# EAGLE design Display-Board_Rack-PDU (EAGLE 9.6.2)
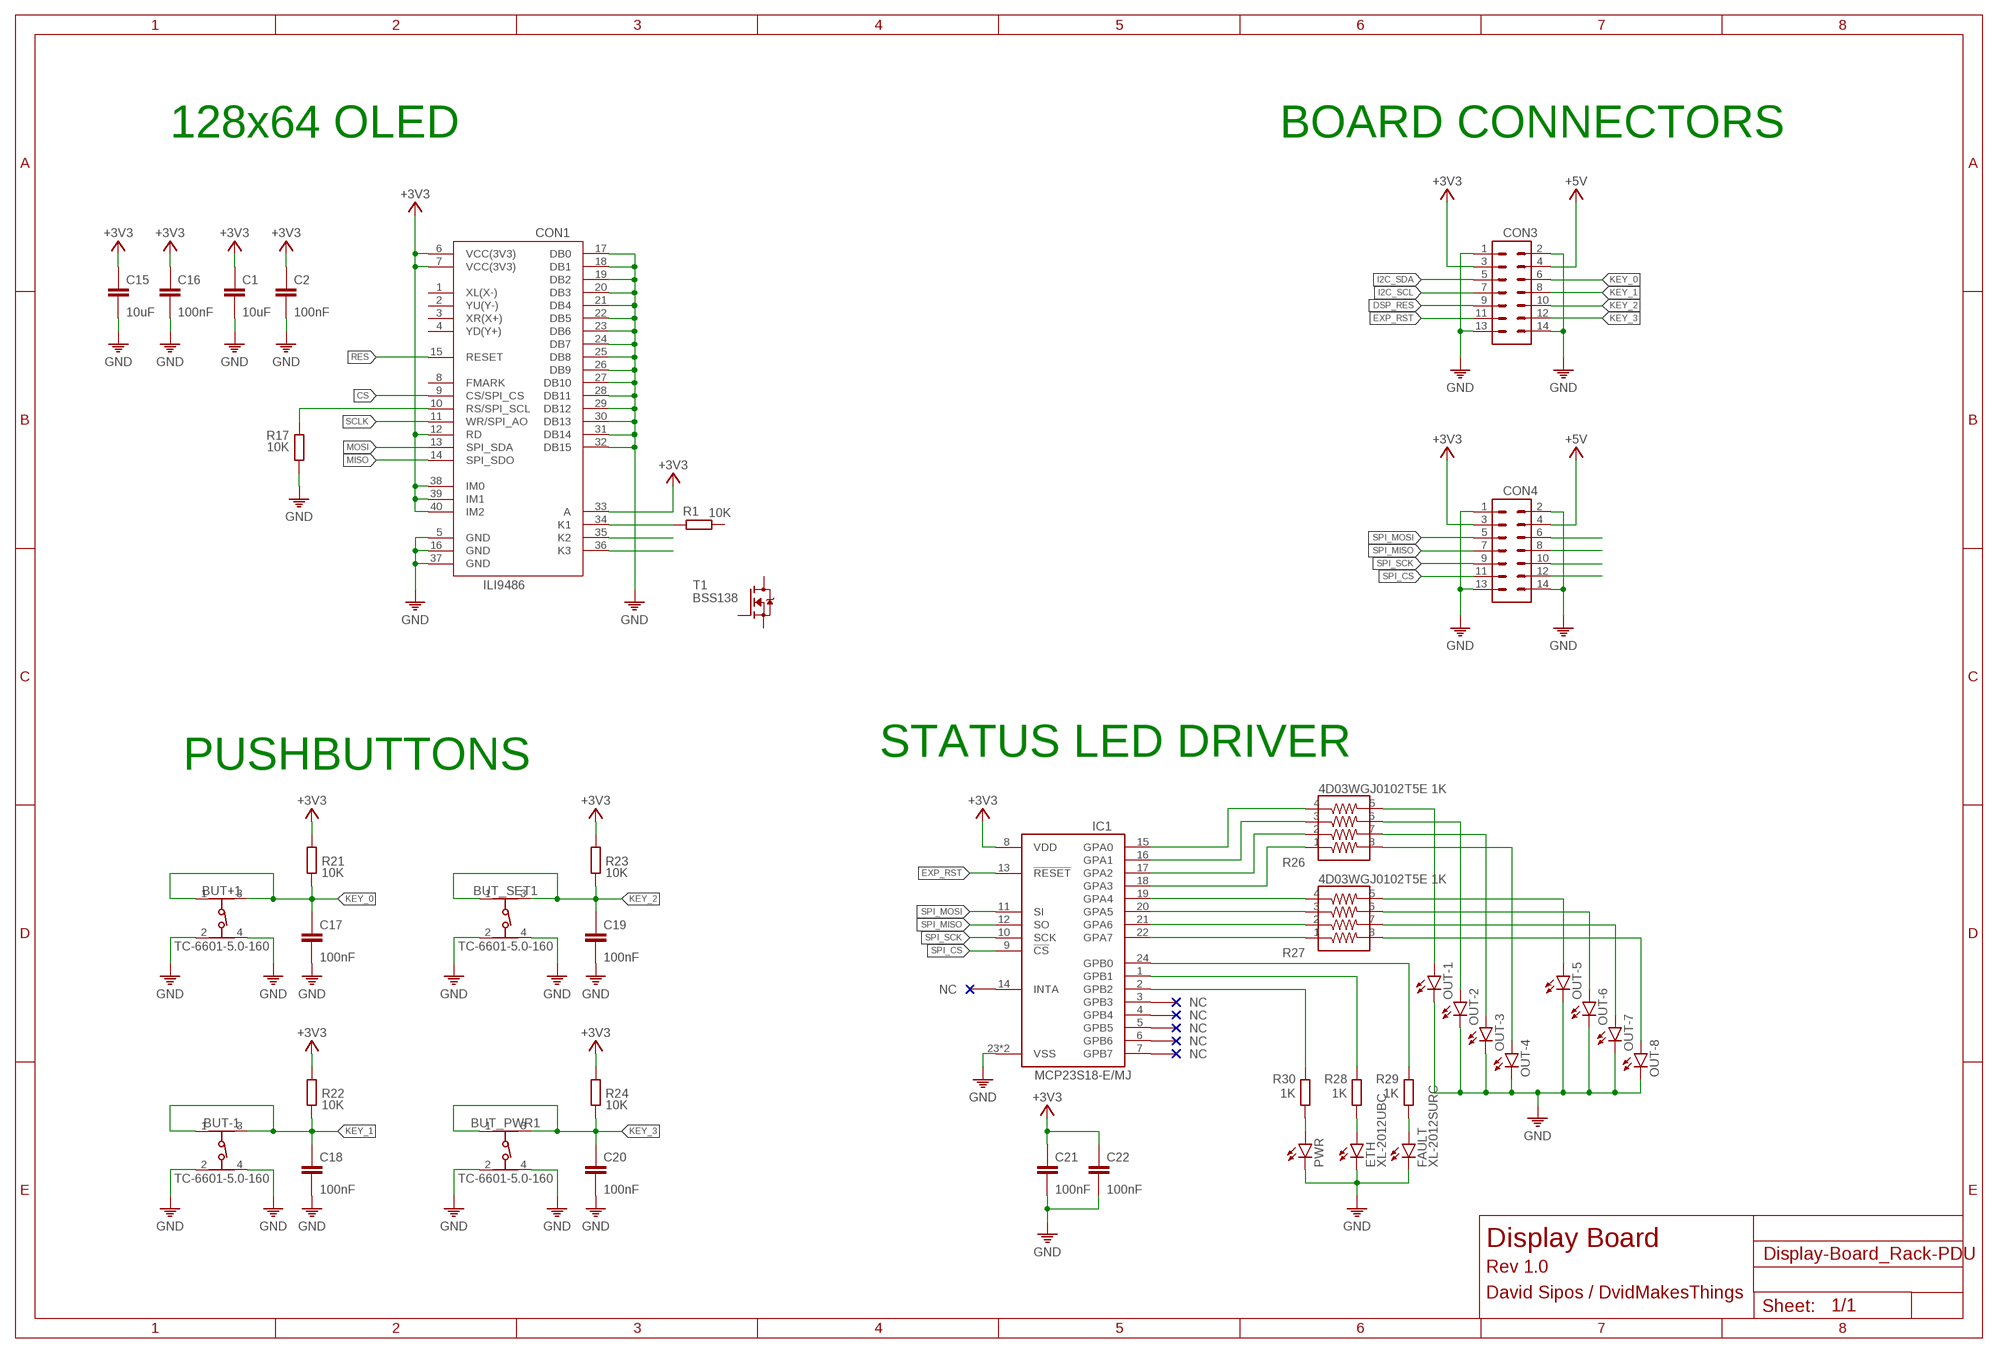
[diagram p0: schematic, sheet 1]

## Parts
BUT+1  TC-6601-5.0-160  430182043816  [430182043816]
BUT-1  TC-6601-5.0-160  430182043816  [430182043816]
BUT_PWR1  TC-6601-5.0-160  430182043816  [430182043816]
BUT_SET1  TC-6601-5.0-160  430182043816  [430182043816]
C1  10uF  C-0402  [C0402]
C2  100nF  C-0402  [C0402]
C15  10uF  C-0402  [C0402]
C16  100nF  C-0402  [C0402]
C17  100nF  C-0402  [C0402]
C18  100nF  C-0402  [C0402]
C19  100nF  C-0402  [C0402]
C20  100nF  C-0402  [C0402]
C21  100nF  C-0402  [C0402]
C22  100nF  C-0402  [C0402]
CON1  3.5IN_TFTLCD  [FPC40]
CON3  CON-2X72  [2X7-SIDE]
CON4  CON-2X72  [2X7-SIDE]
ETH  XL-2012UBC  LEDCHIP-LED0805  [CHIP-LED0805]
FAULT  XL-2012SURC  LEDCHIP-LED0805  [CHIP-LED0805]
IC1  MCP23S18-E/MJ  MCP23S18  [QFN50P400X400X100-25T265]
OUT-1  LEDCHIP-LED0805  [CHIP-LED0805]
OUT-2  LEDCHIP-LED0805  [CHIP-LED0805]
OUT-3  LEDCHIP-LED0805  [CHIP-LED0805]
OUT-4  LEDCHIP-LED0805  [CHIP-LED0805]
OUT-5  LEDCHIP-LED0805  [CHIP-LED0805]
OUT-6  LEDCHIP-LED0805  [CHIP-LED0805]
OUT-7  LEDCHIP-LED0805  [CHIP-LED0805]
OUT-8  LEDCHIP-LED0805  [CHIP-LED0805]
PWR  LEDCHIP-LED0805  [CHIP-LED0805]
R1  10K  R0402  [0402]
R17  10K  R0402  [0402]
R21  10K  R0402  [0402]
R22  10K  R0402  [0402]
R23  10K  R0402  [0402]
R24  10K  R0402  [0402]
R26  4D03WGJ0102T5E 1K  742C083103JP  [742C083103JP]
R27  4D03WGJ0102T5E 1K  742C083103JP  [742C083103JP]
R28  1K  R0402  [0402]
R29  1K  R0402  [0402]
R30  1K  R0402  [0402]
T1  BSS138  [SOT23]

## Nets
+3V3: C1.1 C2.1 C15.1 C16.1 C21.1 C22.1 CON1.6(VCC(3V3)) CON1.7(VCC(3V3)) CON1.12(RD) CON1.33(A) CON1.38(IM0) CON1.39(IM1) CON1.40(IM2) CON3.3 CON4.3 IC1.8(VDD) R21.1 R22.1 R23.1 R24.1
+5V: CON3.4 CON4.4
CS: CON1.9(CS/SPI_CS)
DSP_RES: CON3.9
EXP_RST: CON3.11 IC1.13(!RESET)
GND: BUT+1.2 BUT+1.4 BUT-1.2 BUT-1.4 BUT_PWR1.2 BUT_PWR1.4 BUT_SET1.2 BUT_SET1.4 C1.2 C2.2 C15.2 C16.2 C17.2 C18.2 C19.2 C20.2 C21.2 C22.2 CON1.5(GND) CON1.16(GND) CON1.17(DB0) CON1.18(DB1) CON1.19(DB2) CON1.20(DB3) CON1.21(DB4) CON1.22(DB5) CON1.23(DB6) CON1.24(DB7) CON1.25(DB8) CON1.26(DB9) CON1.27(DB10) CON1.28(DB11) CON1.29(DB12) CON1.30(DB13) CON1.31(DB14) CON1.32(DB15) CON1.37(GND) CON3.1 CON3.2 CON3.13 CON3.14 CON4.1 CON4.2 CON4.13 CON4.14 ETH.C FAULT.C IC1.23(VSS) IC1.25(VSS) OUT-1.C OUT-2.C OUT-3.C OUT-4.C OUT-5.C OUT-6.C OUT-7.C OUT-8.C PWR.C R17.1
I2C_SCL: CON3.7
I2C_SDA: CON3.5
KEY_0: BUT+1.1 BUT+1.3 C17.1 CON3.6 R21.2
KEY_1: BUT-1.1 BUT-1.3 C18.1 CON3.8 R22.2
KEY_2: BUT_SET1.1 BUT_SET1.3 C19.1 CON3.10 R23.2
KEY_3: BUT_PWR1.1 BUT_PWR1.3 C20.1 CON3.12 R24.2
MISO: CON1.14(SPI_SDO)
MOSI: CON1.13(SPI_SDA)
N$1: CON1.10(RS/SPI_SCL) R17.2
N$2: CON1.35(K2)
N$3: CON1.36(K3)
N$5: CON1.34(K1) R1.2
N$42: CON4.6
N$43: CON4.8
N$44: CON4.10
N$45: CON4.12
N$46: IC1.1(GPB1) R28.1
N$47: IC1.2(GPB2) R30.1
N$48: IC1.24(GPB0) R29.1
N$50: IC1.15(GPA0) R26.4
N$51: IC1.16(GPA1) R26.3
N$52: IC1.17(GPA2) R26.2
N$53: IC1.18(GPA3) R26.1
N$54: IC1.19(GPA4) R27.4
N$55: IC1.20(GPA5) R27.3
N$56: IC1.21(GPA6) R27.2
N$57: IC1.22(GPA7) R27.1
N$58: OUT-1.A R26.5
N$59: OUT-2.A R26.6
N$60: OUT-3.A R26.7
N$61: OUT-4.A R26.8
N$62: OUT-5.A R27.5
N$63: OUT-6.A R27.6
N$64: OUT-7.A R27.7
N$65: OUT-8.A R27.8
N$66: FAULT.A R29.2
N$67: ETH.A R28.2
N$68: PWR.A R30.2
RES: CON1.15(RESET)
SCLK: CON1.11(WR/SPI_AO)
SPI_CS: CON4.11 IC1.9(!CS)
SPI_MISO: CON4.7 IC1.12(SO)
SPI_MOSI: CON4.5 IC1.11(SI)
SPI_SCK: CON4.9 IC1.10(SCK)
Unconnected: CON1.1(XL(X-)) CON1.2(YU(Y-)) CON1.3(XR(X+)) CON1.4(YD(Y+)) CON1.8(FMARK) IC1.3(GPB3) IC1.4(GPB4) IC1.5(GPB5) IC1.6(GPB6) IC1.7(GPB7) IC1.14(INTA) R1.1 T1.1(G) T1.2(S) T1.3(D)

## Notes on the sheet
- 128x64 OLED | BOARD CONNECTORS
- PUSHBUTTONS | STATUS LED DRIVER
- Display Board
- Rev 1.0
- David Sipos / DvidMakesThings

## Library data of the parts
BUT+1 BUT-1 BUT_PWR1 BUT_SET1 = Wurth_Switch_WS-TASV:430182043816: WS-TASV SMT Tact Switch 6x6 mm Material Properties Cover Material : Stainless Steel Properties Actuator Material:LCP Actuator Flammability :UL94 V-0 Rating Actuator Color:Black; Salmon; White Frame Material:LCP Flammability Rating:UL94 V-0 Frame Color:Black Contact Material:Stainless Steel Contact Plating:Silver Terminal Material:Copper Alloy Terminal Plating:Silver VR:12 V (DC) Contact Resistance Initial:100 mΩ Contact Resistance After Life Test:2Ω RISO:100 MΩ Withstanding Voltage:250 V (AC) Washable:No Qty.:4000;5000 Mechanical Properties Electrical Life:400; 550; 1000 Stroke :0.25 mm General Information Operating Temperature:-40 up to +85 °C Washable:No Packaging Properties Packaging:Tape and Reel <https://www.we-online.com/catalog/media/o37470v209%20Family_WS-TASV_6x6mm_SMD_Tact_Switch_4301820xx8xx.jpg> Details see: https://www.we-online.com/catalog/en/TASV_6X6_SMD/ Updated by yingchun,Shan;2020-02-18 2020(C) Würth Elektronik; DATASHEET-URL: https://www.we-online.com/redexpert/spec/430182043816?ae; HEIGHT: 4.3mm; OPERATION-FORCE: 160g; PART-NUMBER: 430182043816; QTY: 1000; VALUE: 430182043816
C1 C2 C15-C22 = ds_passive:C
CON1 = ds_displays:3.5IN_TFTLCD
CON3 CON4 = ds_con:CON-2X7
ETH FAULT OUT-1-OUT-8 PWR = led:LED: LED OSRAM: - CHIPLED LG R971, LG N971, LY N971, LG Q971, LY Q971, LO R971, LY R971 LH N974, LH R974 LS Q976, LO Q976, LY Q976 LO Q996 - Hyper CHIPLED LW Q18S LB Q993, LB Q99A, LB R99A - SideLED LS A670, LO A670, LY A670, LG A670, LP A670 LB A673, LV A673, LT A673, LW A673 LH A674 LY A675 LS A676, LA A676, LO A676, LY A676, LW A676 LS A679, LY A679, LG A679 - Hyper Micro SIDELED® LS Y876, LA Y876, LO Y876, LY Y876 LT Y87S - SmartLED LW L88C, LW L88S LB L89C, LB L89S, LG L890 LS L89K, LO L89K, LY L89K LS L896, LA L896, LO L896, LY L896 - TOPLED LS T670, LO T670, LY T670, LG T670, LP T670 LSG T670, LSP T670, LSY T670, LOP T670, LYG T670 LG T671, LOG T671, LSG T671 LB T673, LV T673, LT T673, LW T673 LH T674 LS T676, LA T676, LO T676, LY T676, LB T676, LH T676, LSB T676, LW T676 LB T67C, LV T67C, LT T67C, LS T67K, LO T67K, LY T67K, LW E67C LS E67B, LA E67B, LO E67B, LY E67B, LB E67C, LV E67C, LT E67C LW T67C LS T679, LY T679, LG T679 LS T770, LO T770, LY T770, LG T770, LP T770 LB T773, LV T773, LT T773, LW T773 LH T774 LS E675, LA E675, LY E675, LS T675 LS T776, LA T776, LO T776, LY T776, LB T776 LHGB T686 LT T68C, LB T68C - Hyper Mini TOPLED® LB M676 - Mini TOPLED Santana® LG M470 LS M47K, LO M47K, LY M47K Source: http://www.osram.convergy.de LUXEON: - LUMILED® LXK2-PW12-R00, LXK2-PW12-S00, LXK2-PW14-U00, LXK2-PW14-V00 LXK2-PM12-R00, LXK2-PM12-S00, LXK2-PM14-U00 LXK2-PE12-Q00, LXK2-PE12-R00, LXK2-PE12-S00, LXK2-PE14-T00, LXK2-PE14-U00 LXK2-PB12-K00, LXK2-PB12-L00, LXK2-PB12-M00, LXK2-PB14-N00, LXK2-PB14-P00, LXK2-PB14-Q00 LXK2-PR12-L00, LXK2-PR12-M00, LXK2-PR14-Q00, LXK2-PR14-R00 LXK2-PD12-Q00, LXK2-PD12-R00, LXK2-PD12-S00 LXK2-PH12-R00, LXK2-PH12-S00 LXK2-PL12-P00, LXK2-PL12-Q00, LXK2-PL12-R00 Source: www.luxeon.com KINGBRIGHT: KA-3528ASYC Source: www.kingbright.com
IC1 = ds_ic_peripherals:MCP23S18: 16-Bit I/O Expander with Open-Drain Outputs
R1 R17 R21-R24 R28-R30 = ds_passive:R
R26 R27 = Resistor Array:742C083103JP: RES ARRAY 4 RES 10K OHM 1206 Manufacturer's datasheet <https://www.ctscorp.com/wp-content/uploads/74x.pdf>; CREATED_BY: PCBLayout.com; DIGIKEY_PN: 742C083103JPTR-ND; MANUFACTURER: CTS Resistor Products; MPN: 742C083103JP; PACKAGE: 1206
T1 = transistor-fet:BSS138: N-Channel Logic Level Enhancement Mode Field Effect Transistor

## Board
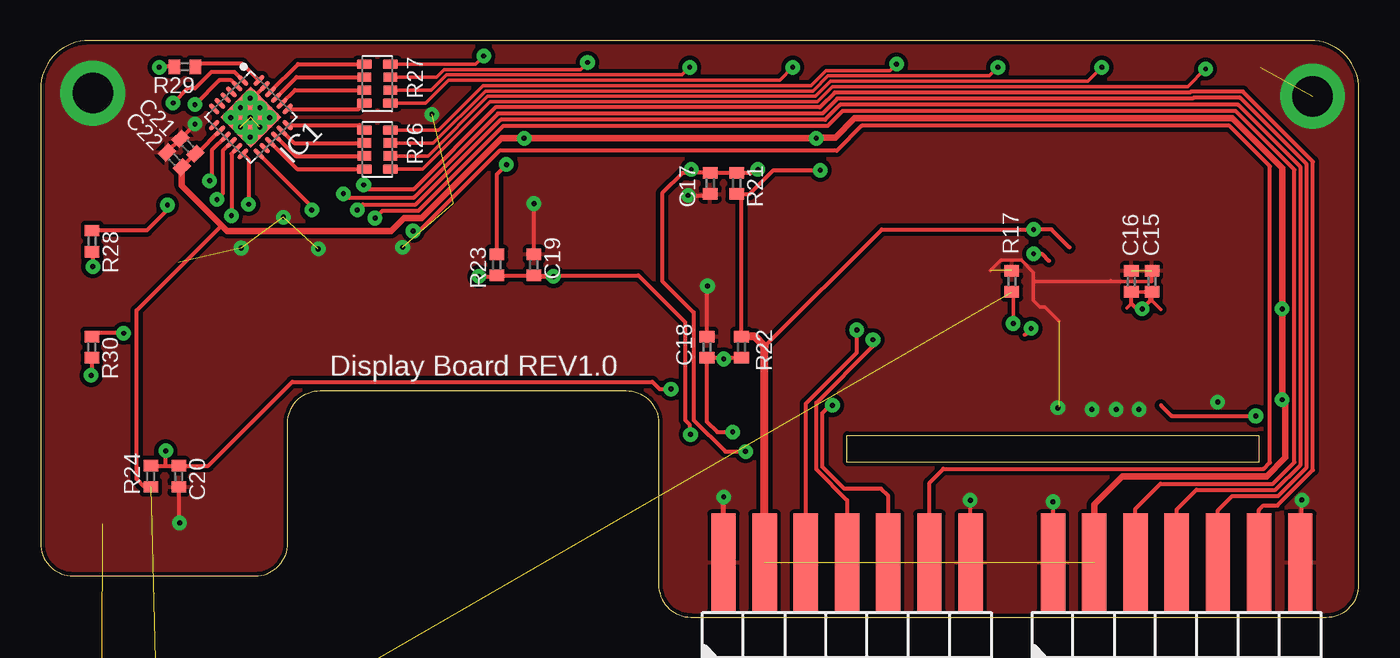
[diagram p1: board, top side]
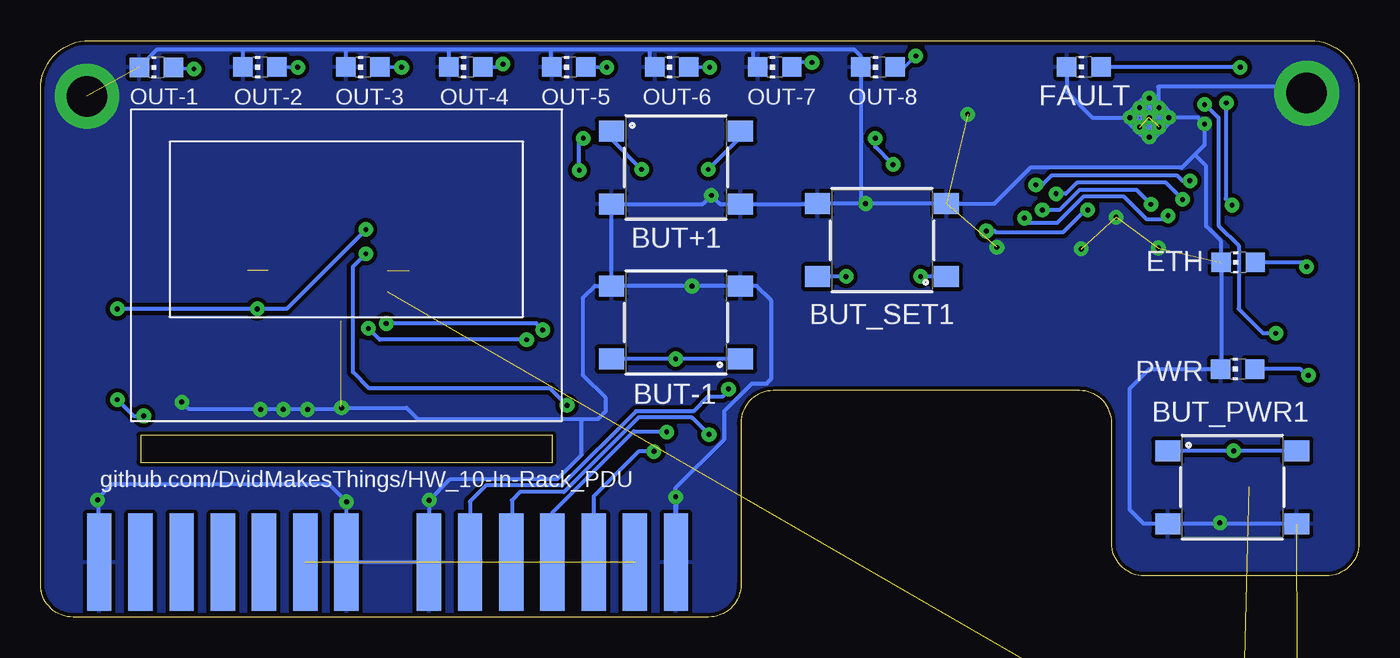
[diagram p2: board, bottom side, seen from below]

Size 81.28 x 35.56 mm. Coordinates in mm from the lower left corner, seen from the top.
Outline: 78.28,35.56 3,35.56 arc90 0,32.56 0,4.54 arc90 2,2.54 13.24,2.54 arc90 15.24,4.54 15.24,11.97 arc-90 17.24,13.97 36.1,13.97 arc-90 38.1,11.97 38.1,2 arc90 40.1,0 79.28,0 arc90 81.28,2 81.28,32.56 arc90 78.28,35.56
Outline: 75.12,9.55 49.72,9.55 49.72,11.22 75.12,11.22 75.12,9.55
Copper layers (1*16): Top 0.035mm / dielectric 1.6mm / Bottom 0.035mm
Design rules "jlcpcb-2layers *": minimum track width 5mil, minimum drill 0.3mm, track to track 5mil, track to pad 5mil, pad to pad 5mil, via to via 5mil, smd to smd 5mil, copper to edge 0.2mm, drill to drill 6mil, minimum pad ring 0.45mm, minimum via ring 0.3mm, stop-mask expansion 4mil, vias tented up to drill 0mil, thermal gap 10mil

### Footprints (pad centres in the part's own frame; a part is rotated, then mirrored left to right if it is on the bottom)
430182043816 = smd 1.55 x 1.3: 1 -3.975,2.25; 2 -3.975,-2.25; 3 3.975,2.25; 4 3.975,-2.25
C0402 = smd 0.7 x 0.9: 1 -0.65,0; 2 0.65,0
FPC40 = smd 0.3 x 0.8: 1 -9.79,2.5; 2 -9.29,2.5; 3 -8.79,2.5; 4 -8.29,2.5; 5 -7.79,2.5; 6 -7.29,2.5; 7 -6.79,2.5; 8 -6.29,2.5; 9 -5.79,2.5; 10 -5.29,2.5; 11 -4.79,2.5; 12 -4.29,2.5; 13 -3.79,2.5; 14 -3.29,2.5; 15 -2.79,2.5; 16 -2.29,2.5; 17 -1.79,2.5; 18 -1.29,2.5; 19 -0.79,2.5; 20 -0.29,2.5; 21 0.21,2.5; 22 0.71,2.5; 23 1.21,2.5; 24 1.71,2.5; 25 2.21,2.5; 26 2.71,2.5; 27 3.21,2.5; 28 3.71,2.5; 29 4.21,2.5; 30 4.71,2.5; 31 5.21,2.5; 32 5.71,2.5; 33 6.21,2.5; 34 6.71,2.5; 35 7.21,2.5; 36 7.71,2.5; 37 8.21,2.5; 38 8.71,2.5; 39 9.21,2.5; 40 9.71,2.5
2X7-SIDE = smd 6 x 1.5: 1 -3,-7.62; 3 -3,-5.08; 5 -3,-2.54; 7 -3,0; 9 -3,2.54; 11 -3,5.08; 13 -3,7.62 | smd 6 x 1.5 bottom: 2 -3,-7.62; 4 -3,-5.08; 6 -3,-2.54; 8 -3,0; 10 -3,2.54; 12 -3,5.08; 14 -3,7.62
CHIP-LED0805 = smd 1.2 x 1.2: A 0,-1.05; C 0,1.05
QFN50P400X400X100-25T265 = smd 0.811 x 0.264: 1 -1.951,1.25; 2 -1.951,0.75; 3 -1.951,0.25; 4 -1.951,-0.25; 5 -1.951,-0.75; 6 -1.951,-1.25; 13 1.951,-1.25; 14 1.951,-0.75; 15 1.951,-0.25; 16 1.951,0.25; 17 1.951,0.75; 18 1.951,1.25 | smd 0.264 x 0.811: 7 -1.25,-1.951; 8 -0.75,-1.951; 9 -0.25,-1.951; 10 0.25,-1.951; 11 0.75,-1.951; 12 1.25,-1.951; 19 1.25,1.951; 20 0.75,1.951; 21 0.25,1.951; 22 -0.25,1.951; 23 -0.75,1.951; 24 -1.25,1.951 | smd 2.65 x 2.65: 25 0,0
0402 = smd 0.7 x 0.9: 1 -0.65,0; 2 0.65,0
742C083103JP = smd 0.59 x 0.92: 1 -1.2,-0.8; 2 -0.4,-0.8; 3 0.4,-0.8; 4 1.2,-0.8; 5 1.2,0.8; 6 0.4,0.8; 7 -0.4,0.8; 8 -1.2,0.8
SOT23 = smd 1 x 1.4: 1 -0.95,-1.1; 2 0.95,-1.1; 3 0,1.1

### Placement (x,y rotation side)
BUT+1  42.1,27.73 0 bottom
BUT-1  42.1,18.17 180 bottom
BUT_PWR1  7.81,8.01 0 bottom
BUT_SET1  29.4,23.25 180 bottom
C1  -0.58,-26.26 0 top  (outside the outline)
C2  -0.58,-21.71 0 top  (outside the outline)
C15  68.52,20.71 90 top
C16  67.25,20.71 90 top
C17  41.28,26.75 270 top
C18  41.08,16.65 90 top
C19  30.42,21.73 90 top
C20  8.52,8.68 270 top
C21  9.08,29.05 135 top
C22  8.25,28.21 135 top
CON1  11.57,-13.46 0 top  (outside the outline)
CON3  49.72,0.39 270 top
CON4  70.04,0.39 270 top
ETH  7.44,21.88 90 bottom
FAULT  16.96,33.93 90 bottom
IC1  12.96,30.84 315 top
OUT-1  74.14,33.9 90 bottom
OUT-2  67.75,33.92 90 bottom
OUT-3  61.4,33.92 90 bottom
OUT-4  55.05,33.92 90 bottom
OUT-5  48.7,33.92 90 bottom
OUT-6  42.35,33.92 90 bottom
OUT-7  36,33.92 90 bottom
OUT-8  29.65,33.92 90 bottom
PWR  7.47,15.3 90 bottom
R1  -0.58,-38.21 0 top  (outside the outline)
R17  59.88,20.71 270 top
R21  42.92,26.75 90 top
R22  43.22,16.65 270 top
R23  28.13,21.73 270 top
R24  6.79,8.68 90 top
R26  20.76,28.84 270 top
R27  20.76,32.9 270 top
R28  3.18,23.19 270 top
R29  8.9,33.94 180 top
R30  3.16,16.65 270 top
T1  0.32,-32.41 0 top  (outside the outline)

### Tracks (layer width: path | path; a pad name or v marks a point on that pad's centre or on a via)
+3V3  (via drill 0.3)  (9 unrouted)
  Top 0.203: 66.97,19.06 67.25,19.34 | C16.1 68.42,20.06 C15.1 68.52,19.51 69.07,18.96
  Top 0.254: 69.07,13.06 69.72,12.41 v74.92,12.41 | IC1.8 9.65,28.59 C21.1 C22.1 | R23.1 28.13,27.32 v28.72,27.91 | R21.1 43.22,26.1 | 43.22,26.1 43.71,26.1 45.17,27.56 v48.07,27.56 | R22.1 43.22,26.1 | R24.1 6.4,8.03 5.92,8.51 5.92,18.91 11.17,24.16 | 44.64,16.69 51.86,23.91 v61.22,23.91 62.32,23.91 63.44,22.79 | 68.42,20.06 68.42,19.51 v67.92,19.01 67.57,19.01 67.25,19.34 C16.1 | 76.74,13.31 76.64,13.41 v76.54,13.41
  Top 0.406: CON4.3 64.96,6.95 66.7,8.69 75.59,8.69 76.74,9.84 76.74,13.31 | v76.54,13.41 v76.54,19.01 76.54,27.7 73.49,30.76 50.18,30.76 49.01,29.59 47.87,29.59 v47.82,29.54 v29.82,29.54 28.42,29.54 23.49,24.61 22.42,24.61 21.62,23.81 11.52,23.81 11.17,24.16 8.71,26.62 C22.1
  Top 0.508: CON3.3 44.64,16.69 44.03,17.3 R22.1
  Bottom 0.254: v28.72,27.91 29.82,29.01 v29.82,29.54 | v48.07,27.56 48.07,29.29 v47.82,29.54 | v76.54,13.41 75.54,12.41 v74.92,12.41 | v61.22,23.91 66.12,19.01 v67.92,19.01 v76.54,19.01
+5V  (1 unrouted)
DSP_RES  (via drill 0.3)
  Top 0.254: CON3.9 52.26,7.47 51.82,7.91 49.56,7.91 48.2,9.27 48.2,12.59 48.67,13.06 v48.82,13.06 | v61.22,22.41 61.72,22.41 62.17,21.96
  Bottom 0.254: v48.82,13.06 49.87,14.11 61.02,14.11 62.02,15.11 62.02,21.61 v61.22,22.41
EXP_RST  (via drill 0.3)
  Top 0.254: CON3.11 54.8,8.29 55.65,9.14 75.4,9.14 75.79,9.53 75.79,27.81 73.3,30.3 50.62,30.3 49.08,28.76 28.29,28.76 23.34,23.81 v22.97,23.81 | v16.72,25.11 16.72,25.32 IC1.13
  Bottom 0.254: v22.97,23.81 22.47,23.81 22.42,23.76 18.23,23.76 16.88,25.11 v16.72,25.11
GND  (via drill 0.3, 0.3 pad 0.55, 2.5 pad 4)  (33 unrouted)
  Top 0.203: 61.22,20.71 65.92,20.71 | 65.92,20.71 68.52,20.71 C15.2 | 62.77,18.26 61.92,19.11 61.62,19.11 61.22,19.51 61.22,20.71 | 65.98,20.77 65.92,20.71 | 64.87,12.86 v64.82,12.81 | 66.27,12.86 v66.32,12.81 | 67.67,12.86 v67.72,12.81 | 62.77,12.96 v62.72,12.91 | 58.57,21.36 59.22,22.01 60.47,22.01 61.22,21.26 61.22,20.71
  Top 0.254: CON3.14 57.34,7.19 v57.32,7.21 | v62.42,7.11 CON4.2 | IC1.23 12.96,31.9 IC1.25 | C19.2 v30.42,25.5 | v39.92,26.01 41.19,26.01 C17.2 | C18.2 41.08,20.38 v41.12,20.42 | C20.2 8.52,5.86 v8.57,5.81 | v9.52,30.41 C21.2 C22.2 | CON4.14 77.71,3.44 77.71,7.17 v77.76,7.22
  Top 0.305: CON3.2 42.1,7.39 v42.12,7.41
  Bottom 0.254: OUT-1.C 74.08,35.01 68.92,35.01 | 68.92,35.01 62.32,35.01 | 62.32,35.01 56.22,35.01 | 56.22,35.01 49.82,35.01 | 49.82,35.01 43.72,35.01 | 43.72,35.01 37.32,35.01 | 37.32,35.01 31.12,35.01 30.7,34.59 OUT-8.C 30.7,25.78 v30.42,25.5 | OUT-7.C 37.32,34.18 37.32,35.01 | OUT-6.C 43.72,34.23 43.72,35.01 | OUT-5.C 49.82,33.98 49.82,35.01 | OUT-4.C 56.1,34.89 56.22,35.01 | OUT-3.C 62.45,34.88 62.32,35.01 | OUT-2.C 68.8,34.89 68.92,35.01 | v30.42,25.5 BUT_SET1.2 22.48,25.5 20.27,27.71 10.92,27.71 10.12,28.51 | v30.42,25.5 BUT_SET1.4 33.4,25.48 BUT+1.4 39.39,25.48 v39.92,26.01 40.45,25.48 BUT+1.2 BUT-1.4 | BUT-1.4 v41.12,20.42 BUT-1.2 37.13,20.42 36.22,19.51 36.22,14.71 36.52,14.41 37.42,14.41 39.12,12.71 39.12,10.96 42.12,7.96 v42.12,7.41 | BUT_PWR1.4 8.57,5.76 | 8.57,5.76 BUT_PWR1.2 13.27,5.76 14.12,6.61 14.12,14.11 12.93,15.3 PWR.C 8.49,15.33 ETH.C 8.49,23.18 9.42,24.11 9.42,27.81 10.12,28.51 | v8.57,5.81 8.57,5.76 | v72.57,13.26 72.12,12.81 v67.72,12.81 v66.32,12.81 v64.82,12.81 62.82,12.81 v62.72,12.91 58.72,12.91 58.02,12.21 48.02,12.21 | 48.02,12.21 46.92,12.21 46.42,12.71 46.42,13.51 47.82,14.91 47.82,19.71 47.11,20.42 BUT-1.4 | 48.02,12.21 47.92,12.11 47.92,10.01 49.42,8.51 56.02,8.51 v57.32,7.21 57.32,3.41 CON3.14 CON4.2 v62.42,7.11 63.52,8.21 76.87,8.21 77.81,7.27 v77.76,7.22 77.71,7.17 77.71,3.44 CON4.14 | 10.12,28.51 9.52,29.11 v9.52,30.41 9.92,30.81 v11.72,30.81 | FAULT.C 18.01,32.4 16.42,30.81 v14.12,30.81 | v3.22,32.32 3.22,32.71 12.37,32.71 12.37,30.91
  Bottom 0.305: v42.12,7.41 42.12,3.41 CON3.2
  Bottom 0.813: 12.37,30.16 v11.72,30.81 v12.32,31.41 12.67,31.06 13.17,31.06 | 12.37,30.26 12.37,30.91 12.37,31.46 v12.92,32.01 v13.52,31.41 | 13.27,29.96 v12.92,29.61 12.37,30.16 | 13.27,29.96 v14.12,30.81 v13.52,31.41 | v13.52,31.41 13.17,31.06 | 13.17,31.06 12.37,30.26 | 12.37,30.26 12.37,30.16 | v12.92,30.81 13.27,30.46 13.27,29.96
  other vias: 13.52,30.21 12.32,30.21 78.42,32.12 22.32,22.81 14.97,24.66 17.12,22.71 12.37,22.76 24.12,31.01
  pour Bottom (isolate 0.254): -1.28,36.91 83.52,36.91 83.52,-0.89 -1.28,-0.89
  pour Top (isolate 0.254): -1.08,36.91 83.72,36.91 83.72,-0.89 -1.08,-0.89
I2C_SCL  (via drill 0.3 pad 0.55)
  Top 0.254: CON3.7 49.72,7.21 47.82,9.11 47.82,13.21 51.32,16.71 v51.32,17.11 | v61.07,17.81 60.67,17.41
  Bottom 0.254: v51.32,17.11 60.37,17.11 v61.07,17.81
I2C_SDA  (via drill 0.3 pad 0.55)
  Top 0.203: v59.97,18.11 59.97,19.97
  Top 0.254: CON3.5 47.18,13.17 50.32,16.31 v50.32,17.71
  Bottom 0.254: v50.32,17.71 50.72,18.11 v59.97,18.11
KEY_0  (via drill 0.3)
  Top 0.254: 40.33,27.4 C17.1 R21.2 44.01,27.4 v44.22,27.61 | 40.33,27.4 v40.12,27.61 | 40.33,27.4 40.27,27.4 40.07,27.39 39.57,27.39 38.32,26.14 38.32,20.74 40.27,18.79 40.27,12.16 42.22,10.21 v43.47,10.21
  Bottom 0.254: v40.12,27.61 38.12,29.61 BUT+1.3 | v44.22,27.61 46.08,29.46 BUT+1.1 | v43.47,10.21 44.42,10.21 47.18,7.45 CON3.6
KEY_1  (via drill 0.3)
  Top 0.254: R22.2 42.12,16 | 42.12,16 C18.1 41.07,15.98 41.07,12.06 41.72,11.41 v42.67,11.41 | 42.12,16 v42.12,15.92
  Bottom 0.254: BUT-1.1 v42.12,15.92 BUT-1.3 | v42.67,11.41 42.72,11.46 44.71,11.46 49.72,6.45 CON3.8
KEY_2  (via drill 0.3, 0.3 pad 0.45)
  Top 0.254: v27.02,21.01 28.06,21.01 R23.2 C19.1 | C19.1 30.48,21.01 v31.62,21.01 | C19.1 36.85,21.08 39.74,18.19 39.74,12.15 40,11.89 40,11.33 v40.07,11.26
  Bottom 0.254: BUT_SET1.1 v27.01,21 v27.02,21.01 | v31.62,21.01 BUT_SET1.3 | v40.07,11.26 41.12,12.31 44.42,12.31 49.02,7.71 51.72,7.71 52.22,7.21 52.22,3.35 | 52.22,2.71 52.22,3.35 | 52.22,3.35 CON3.10
KEY_3  (via drill 0.3)
  Top 0.254: R24.2 7.72,9.33 | 7.72,9.33 C20.1 10.34,9.33 15.52,14.51 37.72,14.51 38.17,14.06 v38.87,14.06 | 7.72,9.33 v7.72,10.26
  Bottom 0.254: BUT_PWR1.3 v7.72,10.26 BUT_PWR1.1 | v38.87,14.06 38.87,13.96 39.22,13.61 40.12,13.61 41.04,12.69 44.58,12.69 49.16,8.11 53.82,8.11 54.8,7.13 CON3.12
N$1  (1 unrouted)
N$5  (1 unrouted)
N$46  (via drill 0.3)
  Top 0.254: IC1.1 11.96,33.61 10.52,33.61 9.52,32.61 9.07,32.61 v8.17,31.71 | v7.82,25.41 7.82,25.11 6.55,23.84 R28.1
  Bottom 0.254: v8.17,31.71 8.22,31.66 8.22,25.81 v7.82,25.41
N$47  (via drill 0.3, 0.3 pad 0.45)
  Top 0.254: IC1.2 11.75,33.11 11.02,33.11 v9.52,31.61 | v5.12,17.51 3.37,17.51 R30.1
  Bottom 0.254: v9.52,31.61 9.47,31.61 8.67,30.81 8.67,24.16 7.42,22.91 7.42,19.01 5.92,17.51 v5.12,17.51
N$48
  Top 0.254: R29.1 9.75,34.14 12.42,34.14 IC1.24
N$50
  Top 0.254: IC1.15 15.81,27.64 R26.4
N$51
  Top 0.254: IC1.16 15.72,28.44 R26.3
N$52
  Top 0.254: IC1.17 15.63,29.24 R26.2
N$53
  Top 0.254: IC1.18 19.66,30.34 R26.1
N$54
  Top 0.254: IC1.19 19.6,31.34 R27.4
N$55
  Top 0.254: IC1.20 15.69,32.5 R27.3
N$56
  Top 0.254: IC1.21 15.78,33.3 R27.2
N$57
  Top 0.254: IC1.22 15.87,34.1 R27.1
N$58  (via drill 0.3)
  Top 0.203: R26.5 23.55,27.64 27.7,31.79 47.9,31.79 48.82,32.71 70.72,32.71 v71.82,33.81
  Bottom 0.203: v71.82,33.81 72.99,33.81 OUT-1.A
N$59  (via drill 0.3)
  Top 0.203: R26.6 23.88,28.44 27.56,32.12 47.77,32.12 48.69,33.04 64.55,33.04 v65.42,33.91
  Bottom 0.203: OUT-2.A v65.43,33.92 v65.42,33.91
N$60  (via drill 0.3)
  Top 0.203: R26.7 24.22,29.24 27.43,32.45 47.63,32.45 48.55,33.38 58.49,33.38 v59.02,33.91
  Bottom 0.203: OUT-3.A v59.03,33.92 v59.02,33.91
N$61  (via drill 0.3)
  Top 0.203: R26.8 24.55,30.04 27.29,32.78 47.49,32.78 48.42,33.71 52.37,33.71 v52.77,34.11
  Bottom 0.203: OUT-4.A 52.96,33.92 v52.77,34.11
N$62  (via drill 0.3)
  Top 0.203: R27.5 23.75,31.7 25.16,33.11 45.57,33.11 v46.37,33.91
  Bottom 0.152: OUT-5.A
  Bottom 0.203: OUT-5.A v46.38,33.92 v46.37,33.91
N$63  (via drill 0.3)
  Top 0.203: R27.6 24.08,32.5 25.02,33.44 39.55,33.44 v40.02,33.91
  Bottom 0.152: v40.02,33.91 v40.03,33.92
  Bottom 0.203: v40.02,33.91 OUT-6.A
N$64  (via drill 0.3)
  Top 0.203: R27.7 24.41,33.3 24.88,33.77 33.28,33.77 v33.72,34.21
  Bottom 0.203: v33.72,34.21 34.66,34.21 OUT-7.A
N$65  (via drill 0.3)
  Top 0.203: R27.8 26.81,34.1 v27.32,34.61
  Bottom 0.152: 28.31,34.21 OUT-8.A
  Bottom 0.203: OUT-8.A 28.01,33.92 v27.32,34.61
N$66  (via drill 0.3 pad 0.45)
  Top 0.254: R29.2 7.35,33.94 v7.32,33.91
  Bottom 0.254: v7.32,33.91 15.89,33.91 FAULT.A
N$67  (via drill 0.3)
  Top 0.254: R28.2 3.22,22.5 v3.22,21.61
  Bottom 0.254: v3.22,21.61 3.49,21.88 ETH.A
N$68  (via drill 0.3)
  Top 0.254: R30.2 3.16,14.95 v3.12,14.91
  Bottom 0.254: v3.12,14.91 3.22,14.91 3.61,15.3 PWR.A
SPI_CS  (via drill 0.3)
  Top 0.254: CON4.11 75.12,6.61 75.4,6.89 76.25,6.89 78.44,9.08 78.44,28.09 74.12,32.41 70.92,32.41 70.87,32.36 48.97,32.36 48.05,31.44 28.05,31.44 23.02,26.41 20.17,26.41 v19.92,26.66 | IC1.9 10.56,28.79 10.56,27.05 v10.42,26.91
  Bottom 0.254: v10.42,26.91 10.88,26.91 11.19,27.22 18.95,27.22 19.51,26.66 v19.92,26.66
SPI_MISO  (via drill 0.3)
  Top 0.254: CON4.7 70.04,6.63 71.26,7.85 76.14,7.85 77.68,9.39 77.68,27.75 73.84,31.59 49.29,31.59 48.36,30.67 28.36,30.67 23.14,25.45 19.86,25.45 v19.52,25.11 | IC1.12 12.82,28.23 v12.82,25.46
  Bottom 0.254: v12.82,25.46 13.72,26.36 17.22,26.36 18.47,25.11 v19.52,25.11
SPI_MOSI  (via drill 0.3)
  Top 0.254: CON4.5 67.5,6.69 69.04,8.23 75.98,8.23 77.3,9.55 77.3,27.59 73.68,31.21 49.45,31.21 48.52,30.29 28.52,30.29 23.29,25.07 21.08,25.07 v20.62,24.61 | IC1.11 11.77,28.58 v11.77,24.76
  Bottom 0.254: v11.77,24.76 11.97,24.56 13.12,24.56 14.49,25.93 17,25.93 18.62,24.31 20.32,24.31 v20.62,24.61
SPI_SCK  (via drill 0.3)
  Top 0.254: CON4.9 72.58,6.57 73.48,7.47 76.29,7.47 78.06,9.24 78.06,27.93 73.96,32.03 71.08,32.03 71.03,31.98 49.13,31.98 48.21,31.05 28.2,31.05 23.03,25.88 18.9,25.88 v18.67,26.11 | IC1.10 11.24,28.76 11.24,26.13 v10.87,25.76
  Bottom 0.254: v10.87,25.76 11.9,26.79 17.39,26.79 18.07,26.11 v18.67,26.11

### Text on the board
tPlace: Display Board REV1.0
bPlace: github.com/DvidMakesThings/HW_10-In-Rack_PDU